# EAGLE design orient_test (EAGLE 7.7.0)
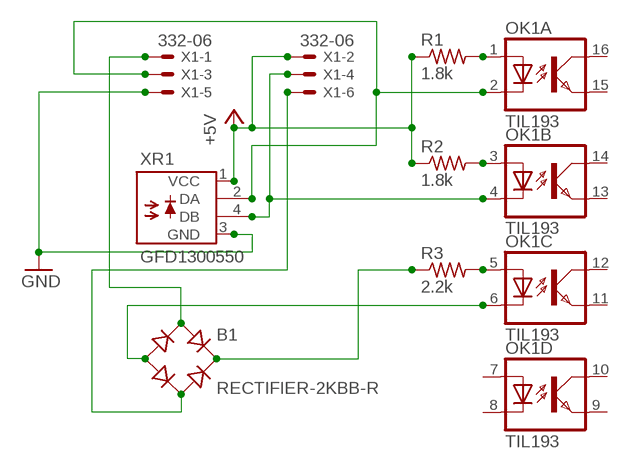
[diagram p0: schematic, sheet 1]

## Parts
B1  RECTIFIER-2KBB-R  [2KBB-R]
OK1  TIL193  [DIL16]
R1  1.8k  R-US_0204/2V  [0204V]
R2  1.8k  R-US_0204/2V  [0204V]
R3  2.2k  R-US_0204/2V  [0204V]
X1  332-06  [332-06]
XR1  GFD1300550  [GFD1300]

## Nets
+5V: R1.1 R2.1 X1.2 XR1.1(VCC)
GND: X1.5 XR1.3(GND)
N$1: OK1.1(A:A) R1.2
N$2: OK1.3(B:A) R2.2
N$3: OK1.5(C:A) R3.2
N$4: OK1.2(A:C) X1.3 XR1.2(DA)
N$5: OK1.4(B:C) X1.4 XR1.4(DB)
N$6: B1.+ R3.1
N$7: B1.- OK1.6(C:C)
N$8: B1.AC1 X1.1
N$9: B1.AC2 X1.6
Unconnected: OK1.7(D:A) OK1.8(D:C) OK1.9(D:EMIT) OK1.10(D:COL) OK1.11(C:EMIT) OK1.12(C:COL) OK1.13(B:EMIT) OK1.14(B:COL) OK1.15(A:EMIT) OK1.16(A:COL)

## Library data of the parts
B1 = rectifier:RECTIFIER-: Rectifier
OK1 = optocoupler:TIL193: TEXAS INSTRUMENTS OPTO COUPLER; OC_FARNELL: 1683365; OC_NEWARK: unknown
R1-R3 = resistor:R-US_: RESISTOR, American symbol
X1 = con-garry:332-06: 6 Pin - 2mm Dual Row Source: www.mpe-connector.de / garry_shortform_2012.pdf
XR1 = opto-honeywell:GFD1300550: OPTO SENSOR DEVICE; OC_FARNELL: unknown; OC_NEWARK: unknown

## Board
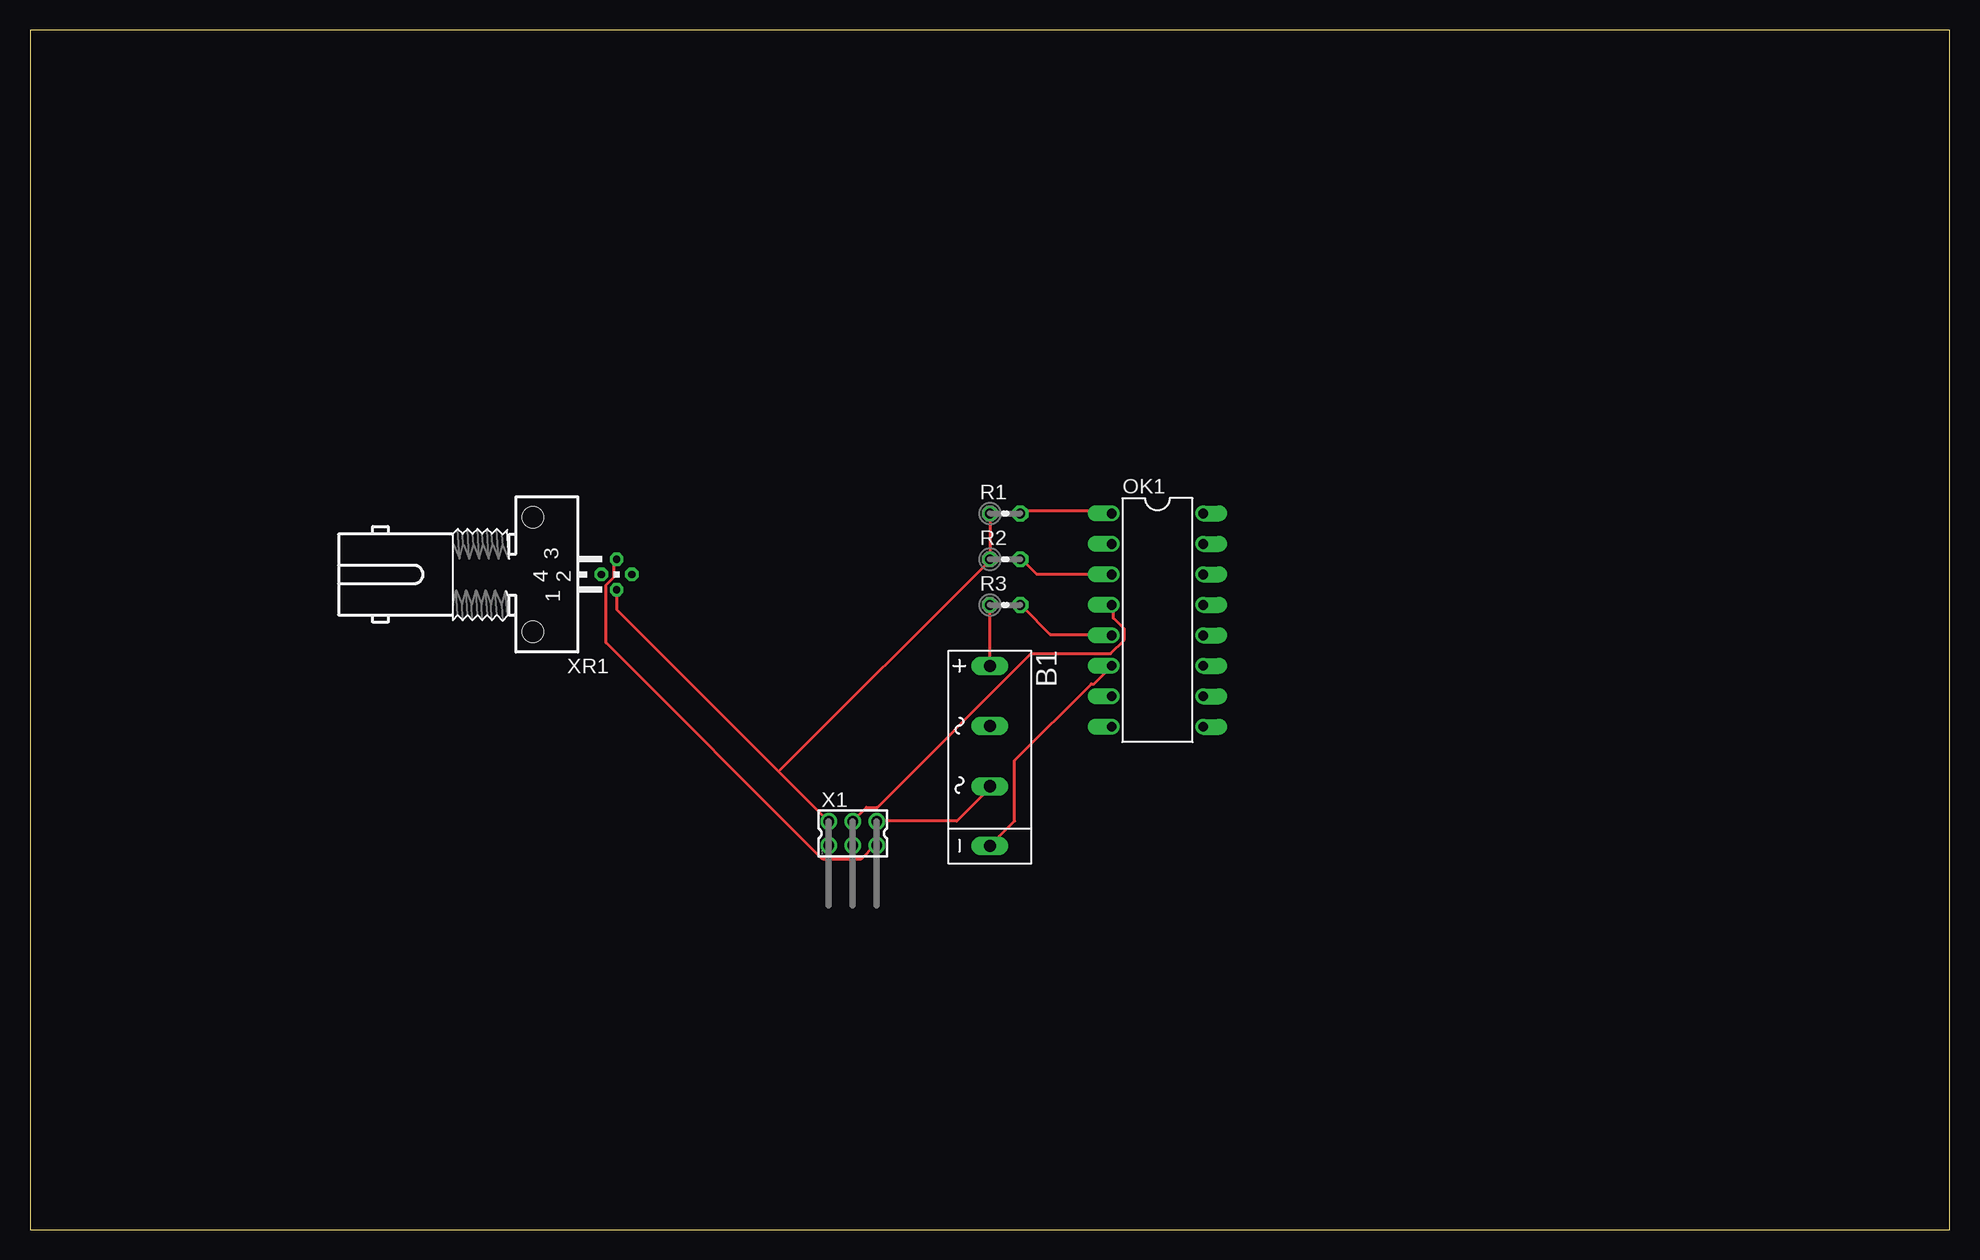
[diagram p1: board, top side]
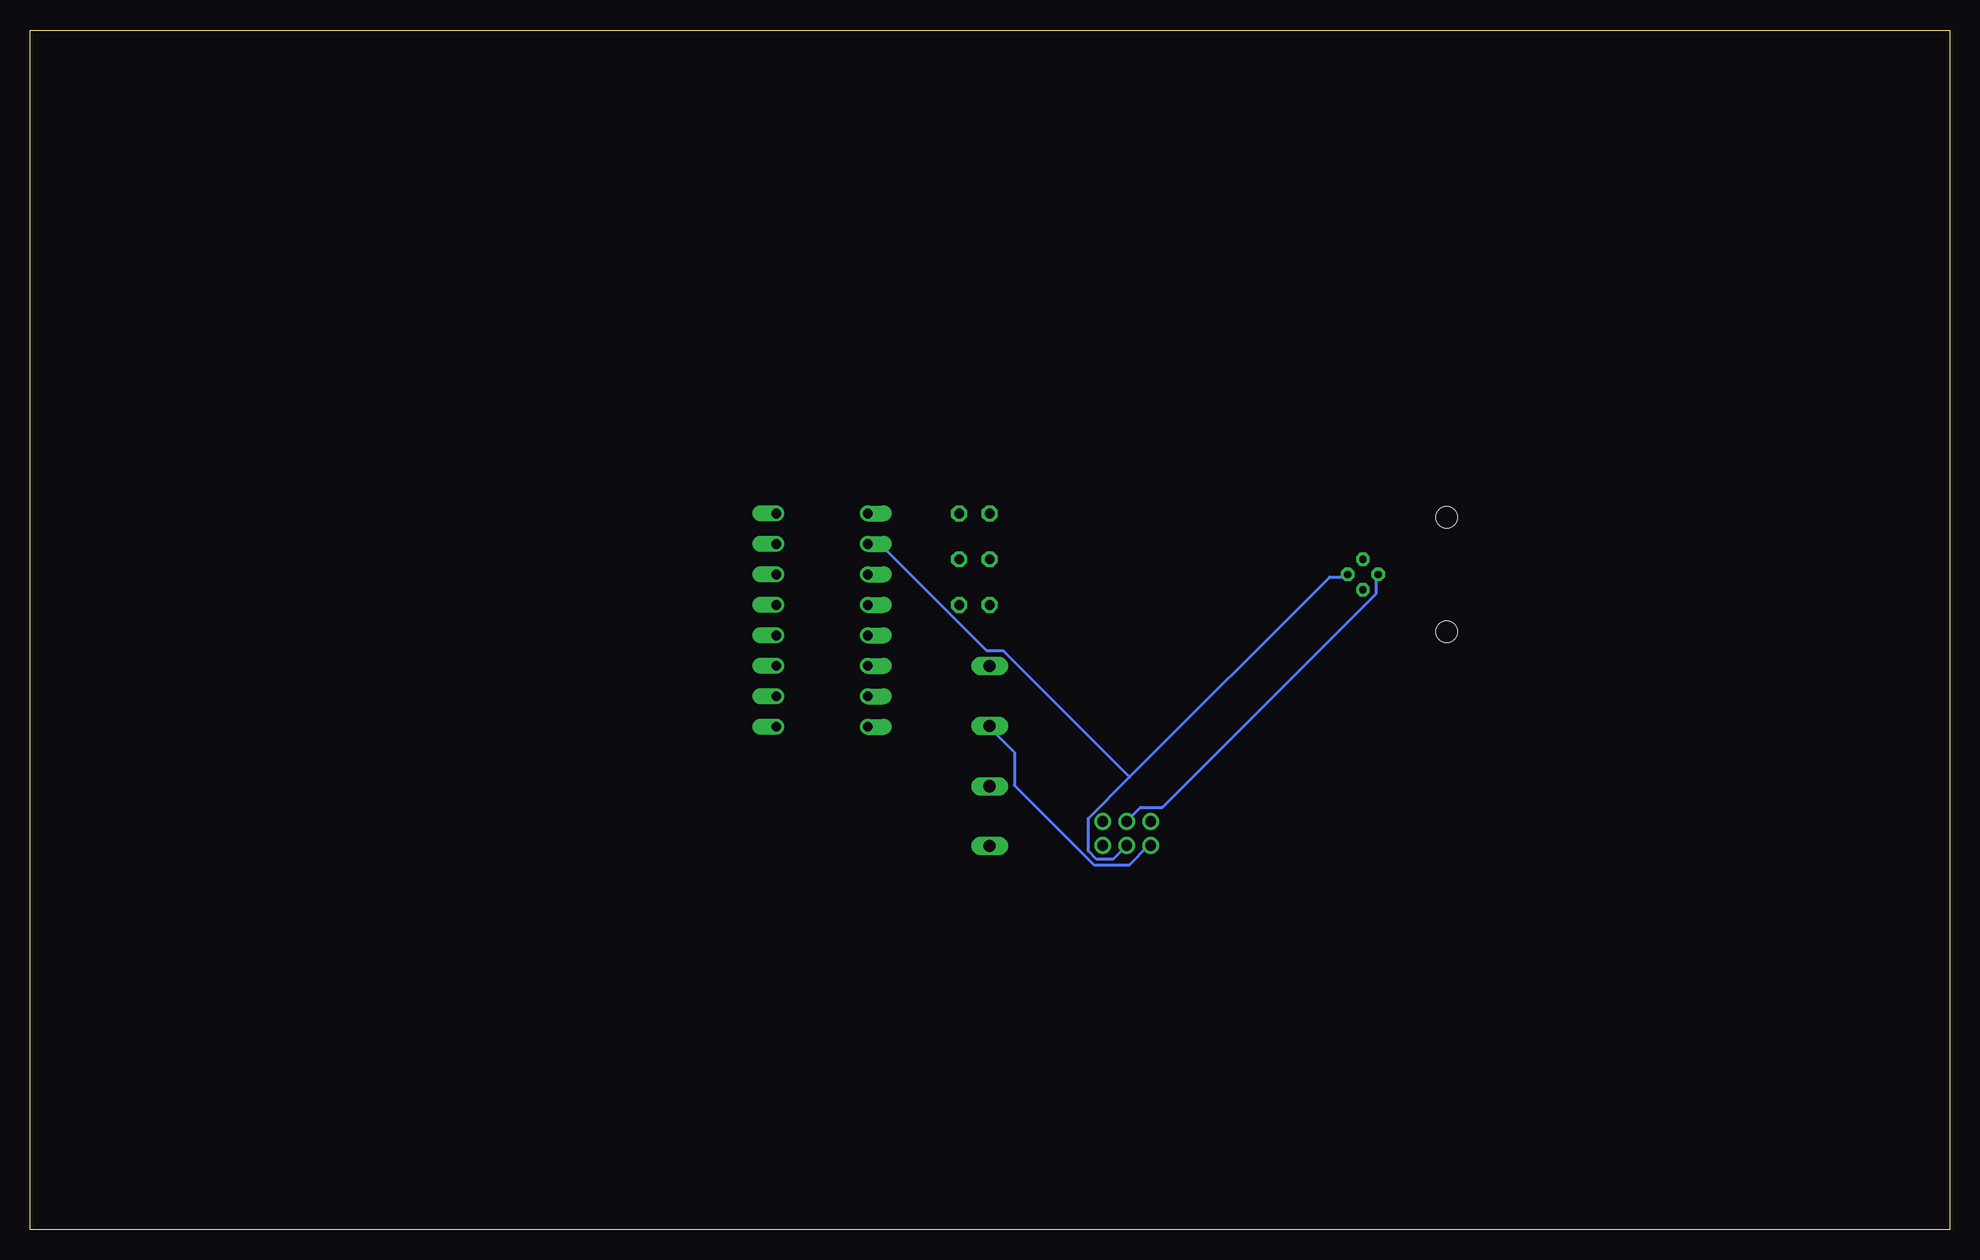
[diagram p2: board, bottom side, seen from below]

Size 160 x 100 mm. Coordinates in mm from the lower left corner, seen from the top.
Outline: 0,0 160,0 160,100 0,100 0,0
Copper layers (1*16): Top 0.035mm / dielectric 1.5mm / Bottom 0.035mm
Design rules "default": minimum track width 10mil, minimum drill 24mil, track to track 8mil, track to pad 8mil, pad to pad 8mil, via to via 8mil, smd to smd 8mil, copper to edge 40mil, drill to drill 8mil, minimum pad ring 10mil, minimum via ring 8mil, stop-mask expansion 4mil, vias tented up to drill 0mil, thermal gap 10mil

### Footprints (pad centres in the part's own frame; a part is rotated, then mirrored left to right if it is on the bottom)
2KBB-R = drill 1.016 long: + -7.62,0; - 7.391,0; AC1 -2.616,0; AC2 2.413,0
DIL16 = drill 0.813 offset: 1 -8.89,-3.81; 2 -6.35,-3.81; 3 -3.81,-3.81; 4 -1.27,-3.81; 5 1.27,-3.81; 6 3.81,-3.81; 7 6.35,-3.81; 8 8.89,-3.81; 9 8.89,3.81; 10 6.35,3.81; 11 3.81,3.81; 12 1.27,3.81; 13 -1.27,3.81; 14 -3.81,3.81; 15 -6.35,3.81; 16 -8.89,3.81
0204V = drill 0.813 octagon: 1 -1.27,0; 2 1.27,0
332-06 = drill 0.9 pad 1.27: 1 -2,-1; 2 -2,1; 3 0,-1; 4 0,1; 5 2,-1; 6 2,1
GFD1300 = drill 0.61 octagon: 1 -6.985,1.27; 2 -8.255,0; 3 -6.985,-1.27; 4 -5.715,0 | hole 1.778: 0,-4.763; 0,4.763

### Placement (x,y rotation side)
B1  80.01,39.37 270 top
OK1  93.98,50.8 270 top
R1  81.28,59.69 0 top
R2  81.28,55.88 0 top
R3  81.28,52.07 0 top
X1  68.58,33.02 0 top
XR1  41.91,54.61 180 top

### Tracks (layer width: path | path; a pad name or v marks a point on that pad's centre or on a via)
+5V
  Top 0.254: R1.1 R2.1 80.01,55.78 62.41,38.18 | 62.41,38.18 66.52,34.06 X1.2 | 62.41,38.18 48.92,51.66 48.92,53.26 XR1.1
GND
  Top 0.254: XR1.3 48.69,55.78 48.69,54.41 48.01,53.72 48.01,48.92 66.06,30.86 69.27,30.86 70.41,32 X1.5
N$1
  Top 0.254: R1.2 82.75,59.89 90.07,59.89 OK1.1
N$2
  Top 0.254: OK1.3 90.07,54.63 83.9,54.63 82.75,55.78 R2.2
N$3
  Top 0.254: OK1.5 90.07,49.61 85.04,49.61 82.75,51.89 R3.2
N$4
  Bottom 0.254: 68.35,37.72 71.78,34.29 71.78,31.55 71.09,30.86 69.72,30.86 68.58,32 X1.3 | 68.35,37.72 51.66,54.41 50.29,54.41 XR1.2 | OK1.2 89.15,57.15 80.24,48.23 78.87,48.23 68.35,37.72
N$5
  Top 0.254: OK1.4 90.3,51.89 90.3,50.98 91.21,50.06 91.21,49.15 90.07,48.01 83.44,48.01 70.64,35.2 69.72,35.2 68.58,34.06 X1.4
  Bottom 0.254: XR1.4 47.78,54.41 47.78,53.03 65.61,35.2 67.44,35.2 68.58,34.06 X1.4
N$6
  Top 0.254: B1.+ R3.1
N$7
  Top 0.254: OK1.6 90.07,46.86 88.7,45.49 88.47,45.49 82.07,39.09 82.07,34.06 80.01,32 B1.-
N$8
  Bottom 0.254: X1.1 66.75,32 68.35,30.4 71.32,30.4 77.95,37.03 77.95,39.78 80.01,41.83 B1.AC1
N$9
  Top 0.254: X1.6 70.64,34.06 77.27,34.06 80.01,36.8 B1.AC2